# EAGLE design main (EAGLE 6.5.0)
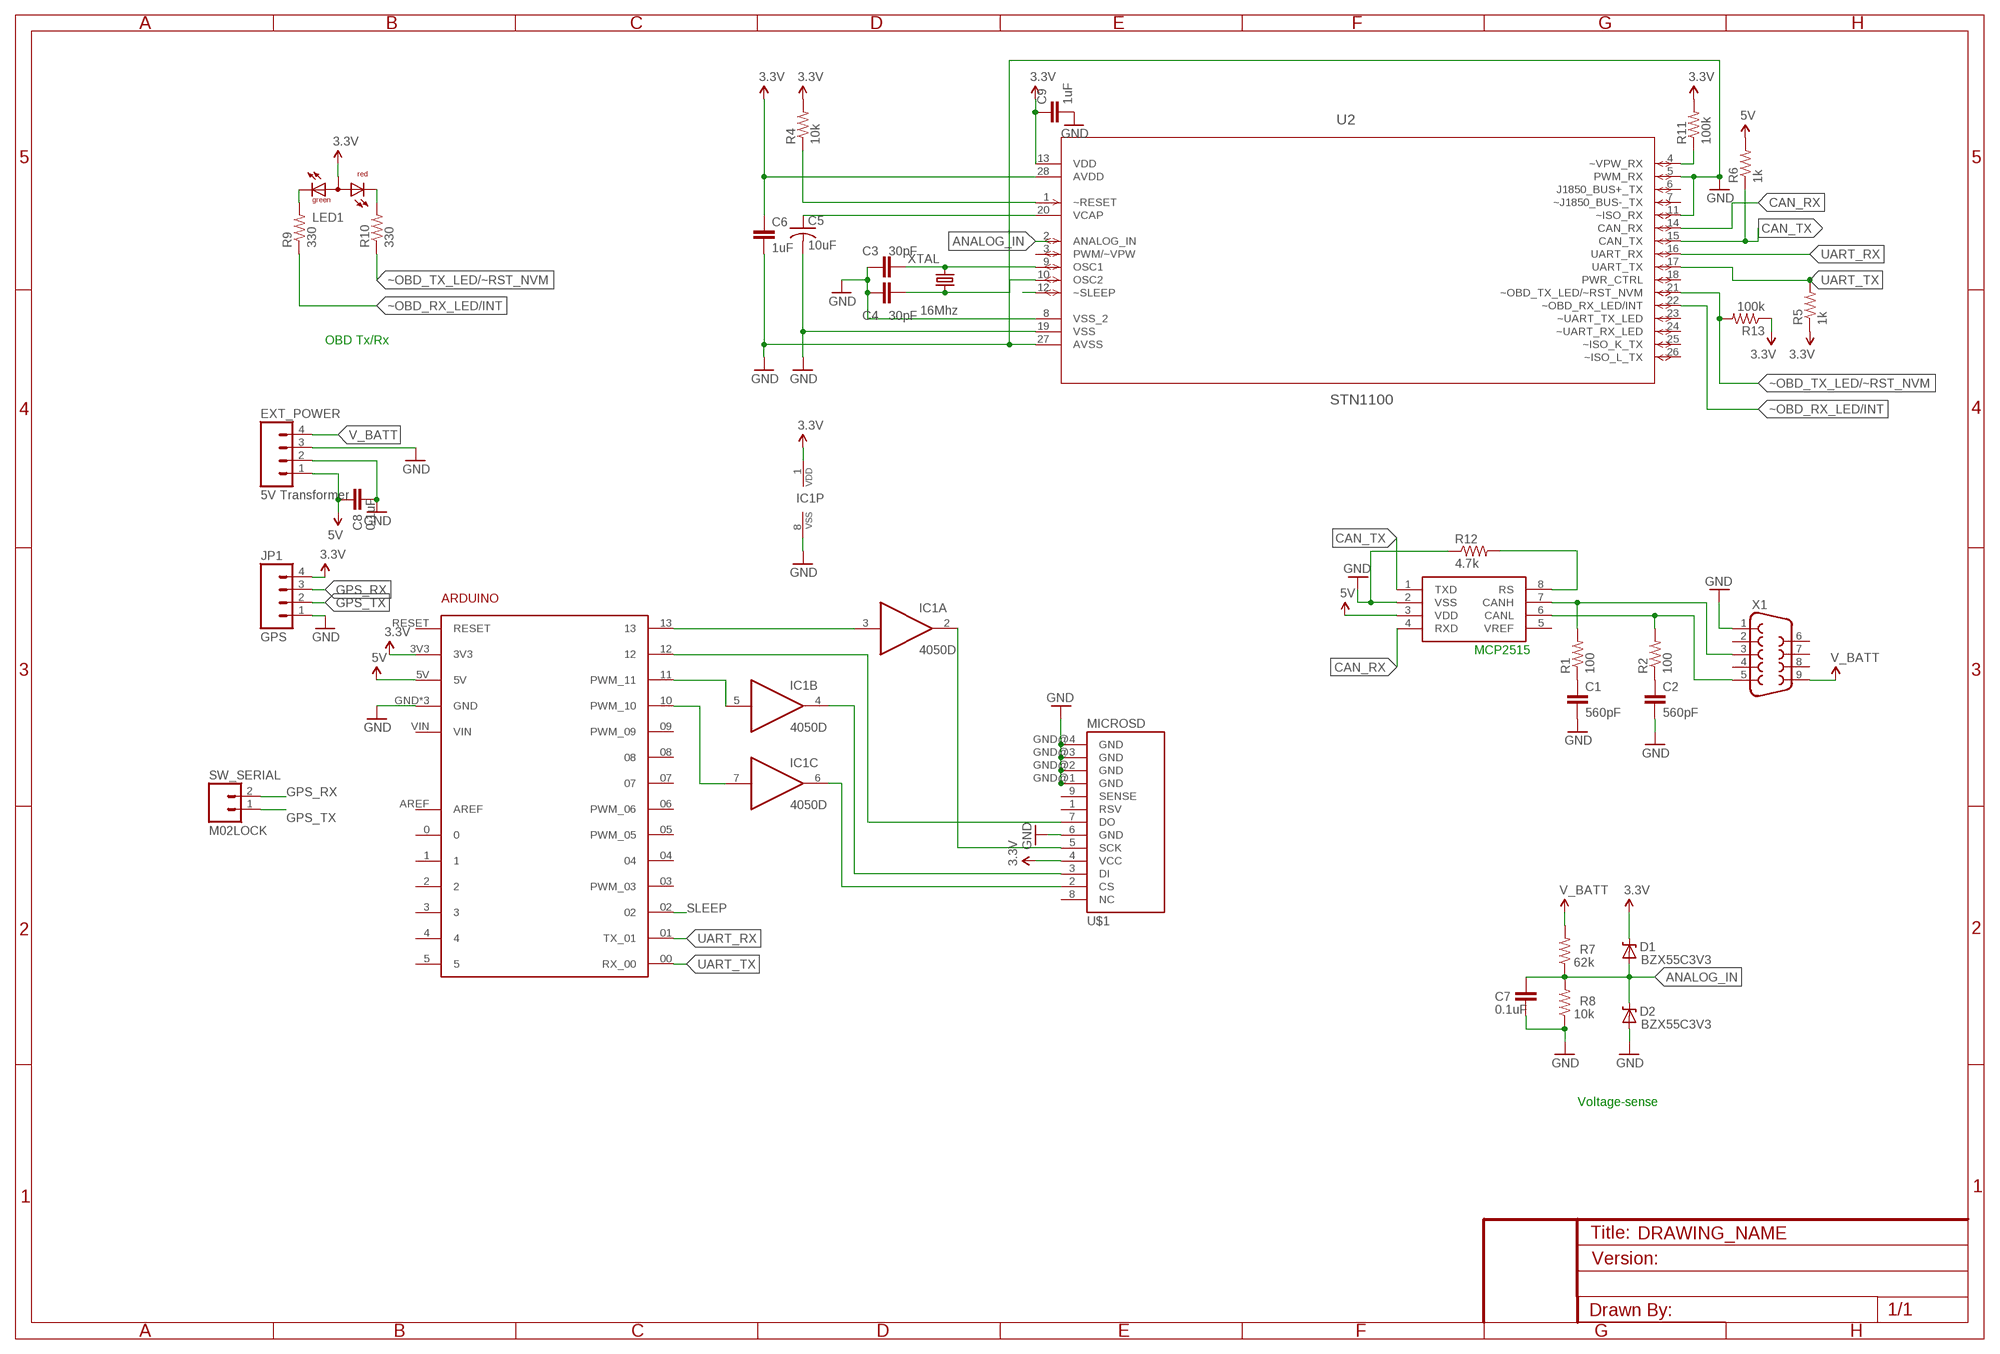
[diagram p0: schematic, sheet 1]

## Parts
ARDUINO1  ARDUINO  [ARDUINO]
C1  560pF  C-EU025-024X044  [C025-024X044]
C2  560pF  C-EU025-024X044  [C025-024X044]
C3  30pF  C2.5/2  [C2.5-2]
C4  30pF  C2.5/2  [C2.5-2]
C5  10uF  C-US025-024X044  [C025-024X044]
C6  1uF  C2.5/2  [C2.5-2]
C7  0.1uF  C2.5/2  [C2.5-2]
C8  0.1uF  C2.5/2  [C2.5-2]
C9  1uF  C2.5/2  [C2.5-2]
D1  BZX55C3V3  DIODE-ZENERPTH  [DIODE-ZENER]
D2  BZX55C3V3  DIODE-ZENERPTH  [DIODE-ZENER]
EXT_POWER  5V Transformer  M04LOCK  [1X04_LOCK]
IC1  4050D  [SO16]
JP1  GPS  M04LOCK  [1X04_LOCK]
LED1  OBD RX/TX  L-115WEGW-CA  [DUOLED-A-3MM]
R1  100  R-US_0204/7  [0204/7]
R2  100  R-US_0204/7  [0204/7]
R4  10k  R-US_0204/7  [0204/7]
R5  1k  R-US_0204/7  [0204/7]
R6  1k  R-US_0204/7  [0204/7]
R7  62k  R-US_0204/7  [0204/7]
R8  10k  R-US_0204/7  [0204/7]
R9  330  R-US_0204/7  [0204/7]
R10  330  R-US_0204/7  [0204/7]
R11  100k  R-US_0204/7  [0204/7]
R12  4.7k  R-US_0204/7  [0204/7]
R13  100k  R-US_0204/7  [0204/7]
SW_SERIAL  M02LOCK  [1X02_LOCK]
U1  MCP2551  MCP2551P-SOCKET  [SOCKET-08]
U2  STN1100  STN1110SOCKET-28  [SOCKET-28-3]
U$1  MICROSD  MICROSD_PP  [MICROSD_PP]
X1  DB9MALE  [DB9_MALE]
XTAL  16Mhz  CRYSTALHC49UV  [HC49U-V]

## Nets
3.3V: ARDUINO1.3V3 C9.1 D1.P$1(C) IC1.1(P:VDD) JP1.4 LED1.2(A) R4.2 R5.1 R11.2 R13.1 U2.13(VDD) U$1.4(VCC)
5V: ARDUINO1.5V C8.1 EXT_POWER.1 R6.2 U1.3(VDD)
ANALOG_IN: C7.1 D1.P$2(A) D2.P$1(C) R7.1 R8.2 U2.2(ANALOG_IN)
CAN_RX: U1.4(RXD) U2.14(CAN_RX)
CAN_TX: R6.1 U1.1(TXD) U2.15(CAN_TX)
GND: ARDUINO1.GND ARDUINO1.GND2(GND) ARDUINO1.GND3(GND) C1.2 C2.2 C3.1 C4.1 C5.2 C6.2 C7.2 C8.2 C9.2 D2.P$2(A) EXT_POWER.2 EXT_POWER.3 IC1.8(P:VSS) JP1.1 R8.1 R12.1 U1.2(VSS) U2.5(PWM_RX) U2.8(VSS_2) U2.11(~ISO_RX) U2.19(VSS) U2.27(AVSS) U$1.6(GND) U$1.GND@1(GND) U$1.GND@2(GND) U$1.GND@3(GND) U$1.GND@4(GND) X1.1
GPS_RX: JP1.3 SW_SERIAL.2
GPS_TX: JP1.2 SW_SERIAL.1
N$1: R1.2 U1.7(CANH) X1.3
N$2: R2.2 U1.6(CANL) X1.5
N$3: C1.1 R1.1
N$4: C2.1 R2.1
N$5: C3.2 U2.9(OSC1) XTAL.2
N$6: C4.2 U2.10(OSC2) XTAL.1
N$7: C5.1 U2.20(VCAP)
N$8: R4.1 U2.1(~RESET)
N$9: C6.1 U2.28(AVDD)
N$10: LED1.1(CG) R9.2
N$11: LED1.3(CR) R10.2
N$12: R11.1 U2.4(~VPW_RX)
N$13: IC1.4(B:O) U$1.3(DI)
N$14: R12.2 U1.8(RS)
N$15: IC1.6(C:O) U$1.2(CS)
N$16: ARDUINO1.13 IC1.3(A:I)
N$17: IC1.2(A:O) U$1.5(SCK)
N$18: ARDUINO1.10(PWM_10) IC1.7(C:I)
N$19: ARDUINO1.12 U$1.7(DO)
N$20: ARDUINO1.11(PWM_11) IC1.5(B:I)
SLEEP: ARDUINO1.02 U2.12(~SLEEP)
UART_RX: ARDUINO1.01(TX_01) U2.16(UART_RX)
UART_TX: ARDUINO1.00(RX_00) R5.2 U2.17(UART_TX)
V_BATT: EXT_POWER.4 R7.2 X1.9
~OBD_RX_LED/INT: R9.1 U2.22(~OBD_RX_LED/INT)
~OBD_TX_LED/~RST_NVM: R10.1 R13.2 U2.21(~OBD_TX_LED/~RST_NVM)
Unconnected: ARDUINO1.0 ARDUINO1.1 ARDUINO1.2 ARDUINO1.3 ARDUINO1.03(PWM_03) ARDUINO1.4 ARDUINO1.04 ARDUINO1.5 ARDUINO1.05(PWM_05) ARDUINO1.06(PWM_06) ARDUINO1.07 ARDUINO1.08 ARDUINO1.09(PWM_09) ARDUINO1.AREF ARDUINO1.RESET ARDUINO1.VIN IC1.9(D:I) IC1.10(D:O) IC1.11(E:I) IC1.12(E:O) IC1.14(F:I) IC1.15(F:O) U1.5(VREF) U2.3(PWM/~VPW) U2.6(J1850_BUS+_TX) U2.7(~J1850_BUS-_TX) U2.18(PWR_CTRL) U2.23(~UART_TX_LED) U2.24(~UART_RX_LED) U2.25(~ISO_K_TX) U2.26(~ISO_L_TX) U$1.1(RSV) U$1.8(NC) U$1.9(SENSE) X1.2 X1.4 X1.6 X1.7 X1.8

## Notes on the sheet
- OBD Tx/Rx
- MCP2515
- Voltage-sense

## Library data of the parts
ARDUINO1 = post7_arduino:ARDUINO: For creating Arduino shields
C1 C2 = rcl:C-EU: CAPACITOR, European symbol
C3 C4 C6-C9 = capacitor-wima:C: CAPACITOR naming: grid - package width
C5 = rcl:C-US: CAPACITOR, American symbol
D1 D2 = SparkFun-DiscreteSemi:DIODE-ZENER: Zener Diode Production Part - 8199 3.4V Zener Voltage
EXT_POWER JP1 = SparkFun-Connectors:M04: Header 4 Standard 4-pin 0.1" header. Use with straight break away headers (SKU : PRT-00116), right angle break away headers (PRT-00553), swiss pins (PRT-00743), machine pins (PRT-00117), and female headers (PRT-00115). Molex polarized connector foot print use with SKU : PRT-08231 with associated crimp pins and housings. 1MM SMD Version SKU: PRT-10208
IC1 = 40xx:4050: Hex non-inverting BUFFER
LED1 = led:L-115WEGW-CA: T-1(3mm) BI-COLOR INDICATOR LAMP Source: Kingbright .. 2_colour_led_.pdf
R1 R2 R4-R13 = resistor:R-US_: RESISTOR, American symbol
SW_SERIAL = SparkFun-Connectors:M02: Standard 2-pin 0.1" header. Use with - straight break away headers ( PRT-00116) - right angle break away headers (PRT-00553) - swiss pins (PRT-00743) - machine pins (PRT-00117) - female headers (PRT-00115) Molex polarized connector foot print use with: PRT-08233 with associated crimp pins and housings. 2.54_SCREWTERM for use with PRT-10571. 3.5mm Screw Terminal footprints for PRT-08084 5mm Screw Terminal footprints for use with PRT-08433
U1 = personal:MCP2551: CAN transceiver
U2 = personal:STN1110: 16-bit Microcontrollers
U$1 = DE1594-v2:MICROSD_PP
X1 = SparkFun-Connectors:DB9: DB9 Connector Standard DB9 (D-Sub 9) serial connector. Can be used for CAN bus as well as RS485 and RS232. Footprint production proven. Spark Fun Electronics SKU : PRT-00429
XTAL = SparkFun-FreqCtrl:CRYSTAL: Various standard crystals. Proven footprints. Spark Fun Electronics SKU : COM-00534

## Board
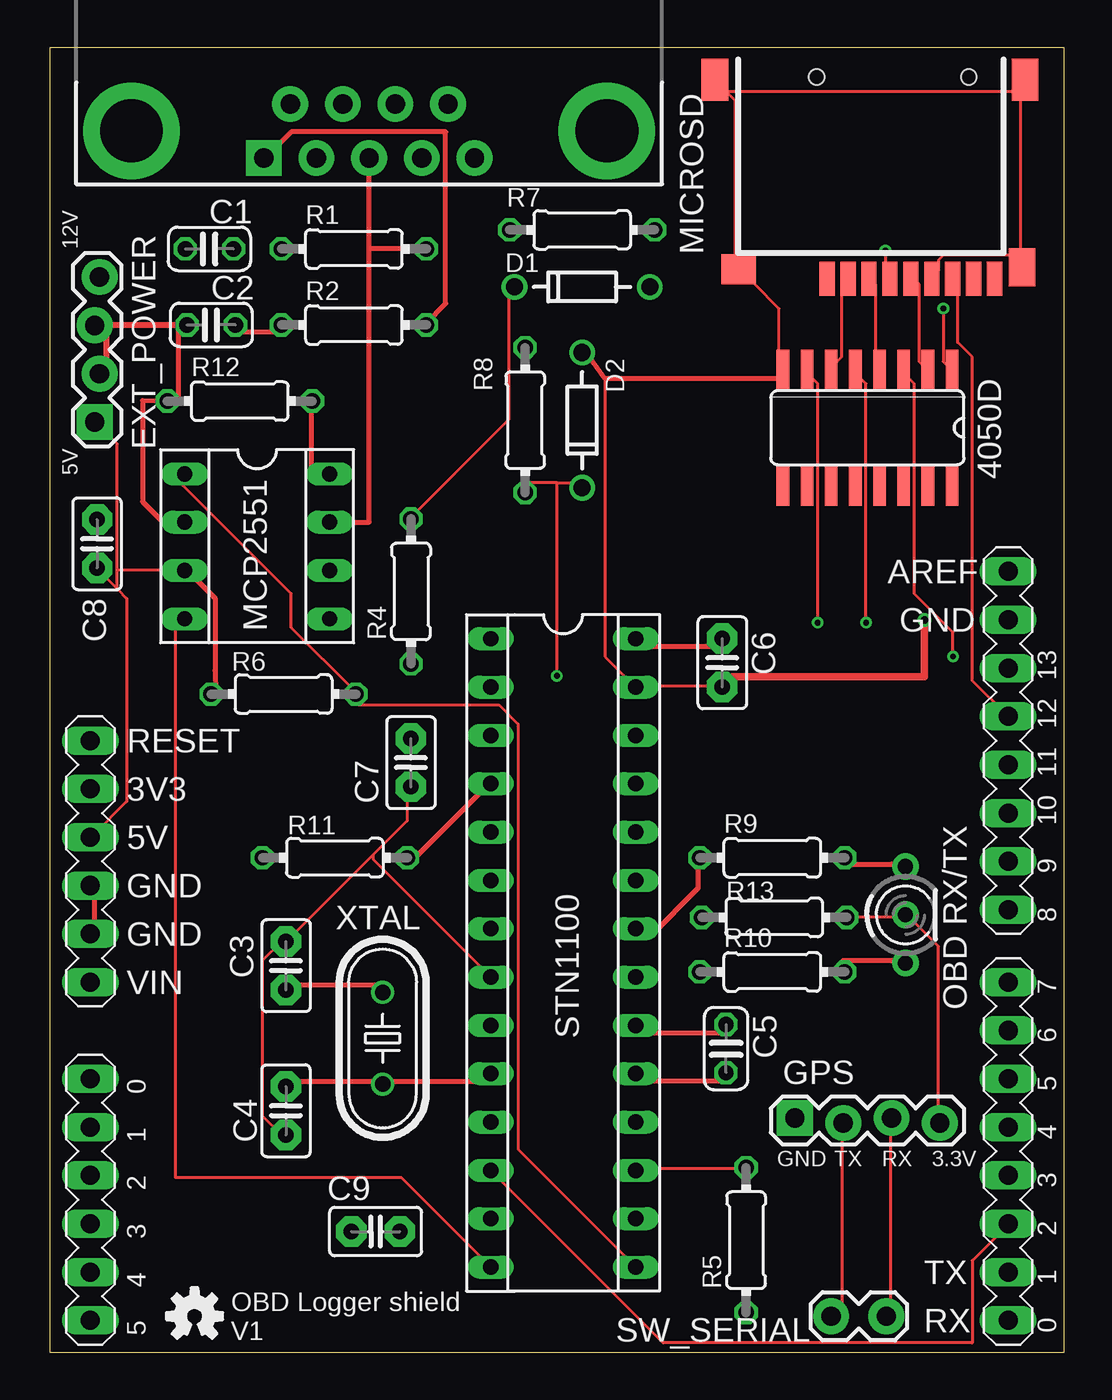
[diagram p1: board, top side]
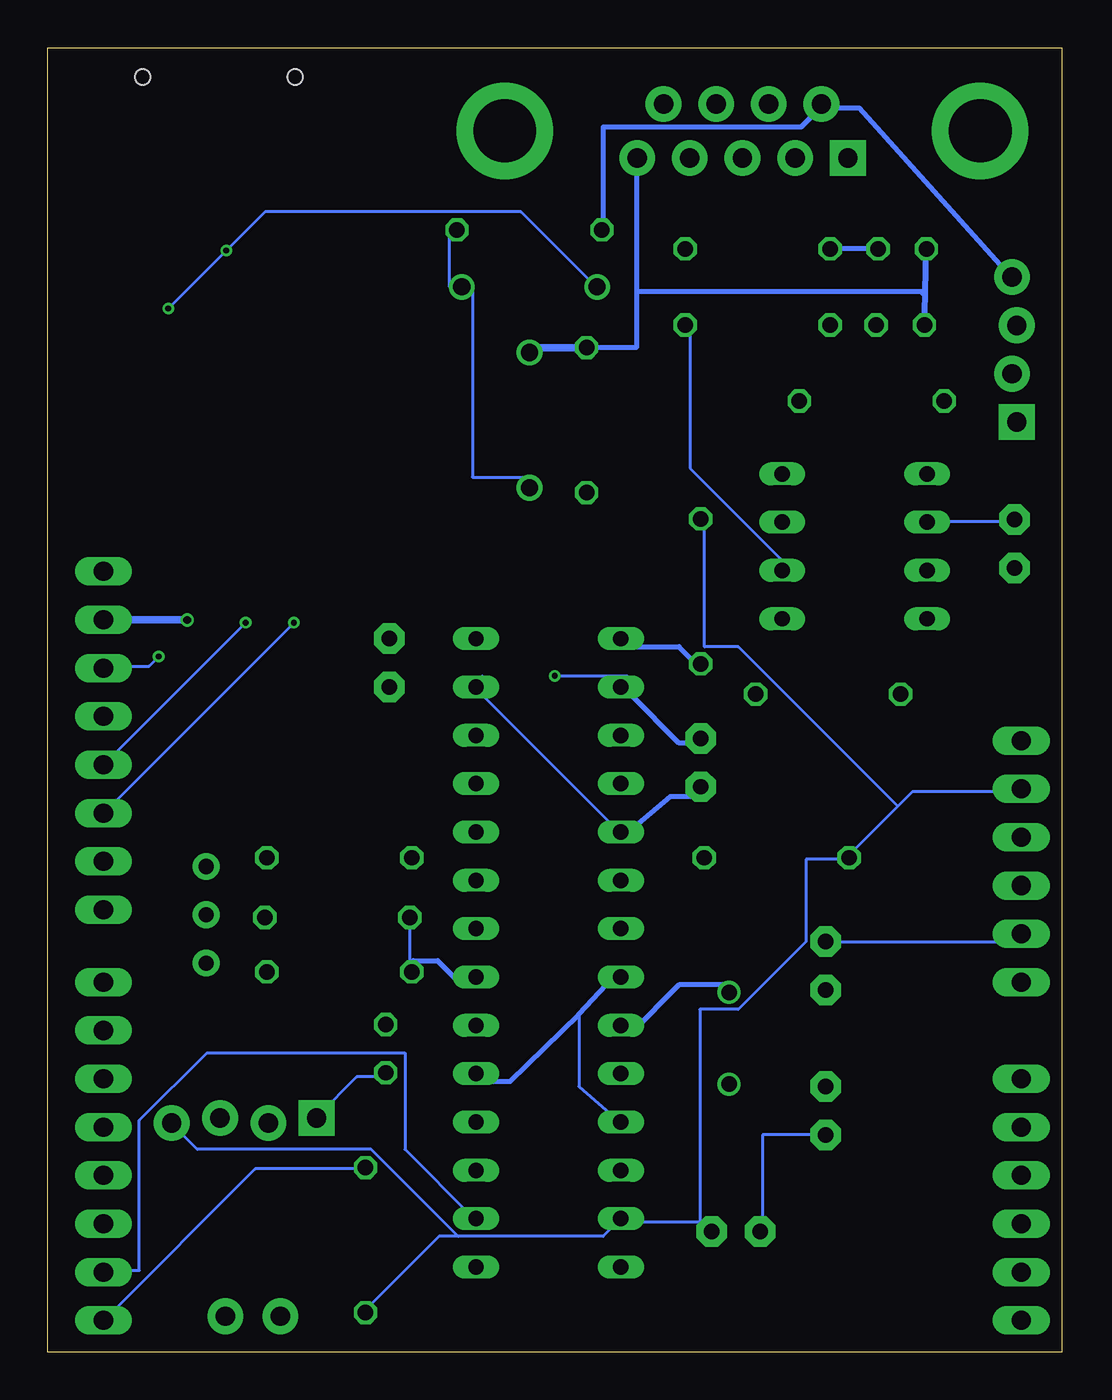
[diagram p2: board, bottom side, seen from below]

Size 53.34 x 68.58 mm. Coordinates in mm from the lower left corner, seen from the top.
Outline: 0,0 53.34,0 53.34,68.58 0,68.58 0,0
Copper layers (1*2*15*16): Top 0.035mm / dielectric 0.2mm / layer 2 0.0175mm / dielectric 1.1mm / layer 15 0.0175mm / dielectric 0.2mm / Bottom 0.035mm
Design rules "SeeedStudio_DRU_no_angle_20130527": minimum track width 6mil, minimum drill 12mil, track to track 6mil, track to pad 6mil, pad to pad 6mil, via to via 6mil, smd to smd 0mil, copper to edge 10mil, drill to drill 10mil, minimum pad ring 6mil, minimum via ring 6mil, stop-mask expansion 2mil, vias tented up to drill 25mil, thermal gap 10mil

### Footprints (pad centres in the part's own frame; a part is rotated, then mirrored left to right if it is on the bottom)
ARDUINO = drill 1 long: 00 25.4,-20.32; 0 -22.86,-7.62; 01 25.4,-17.78; 1 -22.86,-10.16; 02 25.4,-15.24; 2 -22.86,-12.7; 03 25.4,-12.7; 3 -22.86,-15.24; 3V3 -22.86,7.62; 04 25.4,-10.16; 4 -22.86,-17.78; 05 25.4,-7.62; 5 -22.86,-20.32; 5V -22.86,5.08; 06 25.4,-5.08; 07 25.4,-2.54; 08 25.4,1.27; 09 25.4,3.81; 10 25.4,6.35; 11 25.4,8.89; 12 25.4,11.43; 13 25.4,13.97; AREF 25.4,19.05; GND -22.86,0; GND2 -22.86,2.54; GND3 25.4,16.51; RESET -22.86,10.16; VIN -22.86,-2.54
C025-024X044 = drill 0.813 octagon: 1 -1.27,0; 2 1.27,0
C2.5-2 = drill 0.813 pad 1.6 octagon: 1 -1.27,0; 2 1.27,0
DIODE-ZENER = drill 0.9: P$1 -3.556,0; P$2 3.556,0
1X04_LOCK = drill 1.016 pad 1.88 square: 1 0,0.127 | drill 1.016 pad 1.88: 2 2.54,-0.127; 3 5.08,0.127; 4 7.62,-0.127
SO16 = smd 0.66 x 2.032: 1 -4.445,-3.073; 2 -3.175,-3.073; 3 -1.905,-3.073; 4 -0.635,-3.073; 5 0.635,-3.073; 6 1.905,-3.073; 7 3.175,-3.073; 8 4.445,-3.073; 9 4.445,3.073; 10 3.175,3.073; 11 1.905,3.073; 12 0.635,3.073; 13 -0.635,3.073; 14 -1.905,3.073; 15 -3.175,3.073; 16 -4.445,3.073
DUOLED-A-3MM = drill 0.8 pad 1.4: 1 -2.54,0; 2 0,0; 3 2.54,0
0204/7 = drill 0.813 octagon: 1 -3.81,0; 2 3.81,0
1X02_LOCK = drill 1.016 pad 1.88: 1 -0.178,0; 2 2.718,0
SOCKET-08 = drill 0.813 long: 1 -3.81,-3.81; 2 -1.27,-3.81; 3 1.27,-3.81; 4 3.81,-3.81; 5 3.81,3.81; 6 1.27,3.81; 7 -1.27,3.81; 8 -3.81,3.81
SOCKET-28-3 = drill 0.813 long: 1 -16.51,-3.81; 2 -13.97,-3.81; 3 -11.43,-3.81; 4 -8.89,-3.81; 5 -6.35,-3.81; 6 -3.81,-3.81; 7 -1.27,-3.81; 8 1.27,-3.81; 9 3.81,-3.81; 10 6.35,-3.81; 11 8.89,-3.81; 12 11.43,-3.81; 13 13.97,-3.81; 14 16.51,-3.81; 15 16.51,3.81; 16 13.97,3.81; 17 11.43,3.81; 18 8.89,3.81; 19 6.35,3.81; 20 3.81,3.81; 21 1.27,3.81; 22 -1.27,3.81; 23 -3.81,3.81; 24 -6.35,3.81; 25 -8.89,3.81; 26 -11.43,3.81; 27 -13.97,3.81; 28 -16.51,3.81
MICROSD_PP = smd 1.8 x 0.8: 1 0,3.85; 2 0,2.75; 3 0,1.65; 4 0,0.55; 5 0,-0.55; 6 0,-1.65; 7 0,-2.75; 8 0,-3.85; 9 0,-4.95 | smd 1.6 x 1.8: GND@1 0.5,8.5 | smd 2.2 x 1.4: GND@2 10.45,9.75; GND@4 10.45,-6.55 | smd 2 x 1.4: GND@3 0.6,-6.4 | hole 0.8: 10.6,4.4; 10.6,-3.6
DB9_MALE = drill 1.016 pad 1.88: 1 5.54,-1.42; 2 2.77,-1.42; 3 0,-1.42; 4 -2.77,-1.42; 6 4.15,1.42; 7 1.38,1.42; 8 -1.38,1.42; 9 -4.15,1.42 | drill 1.016 pad 1.88 square: 5 -5.54,-1.42 | drill 3.302 pad 5.08: G1 -12.5,0; G2 12.5,0
HC49U-V = drill 0.813: 1 -2.413,0; 2 2.413,0

### Placement (x,y rotation side)
ARDUINO1  25,22 0 top
C1  8.4,58 180 top
C2  8.5,54 180 top
C3  12.43,20.32 270 top
C4  12.43,12.7 90 top
C5  35.56,15.97 270 top
C6  35.37,36.25 270 top
C7  19,31 270 top
C8  2.5,42.5 90 top
C9  17.14,6.35 180 top
D1  28,56 0 top
D2  28,49 90 top
EXT_POWER  2.5,48.9 90 top
IC1  43,48.6 180 top
JP1  39.19,12.19 0 top
LED1  45,23 270 top
R1  16,58 0 top
R2  16,54 0 top
R4  19,40 90 top
R5  36.62,5.9 90 top
R6  12.3,34.6 180 top
R7  28,59 180 top
R8  25,49 270 top
R9  38,26 0 top
R10  38,20 0 top
R11  15,26 180 top
R12  10,50 0 top
R13  38.1,22.86 180 top
SW_SERIAL  41.27,1.91 0 top
U1  10.91,42.37 270 top
U2  27,21 270 top
U$1  44.73,56.43 90 top
U$2  [OSHW-LOGO-S]  7.62,1.91 0 top
X1  16.8,64.2 0 top
XTAL  17.51,16.51 90 top

### Tracks (layer width: path | path; a pad name or v marks a point on that pad's centre or on a via)
3.3V  (via drill 0.3)
  Top 0.152: v43.94,57.91 43.94,56.64 U$1.4 | v46.99,54.86 46.99,52.07 47.24,51.82 IC1.1 | R13.1 44.96,22.86 LED1.2 45.21,22.86 46.74,21.34 46.74,12.19 JP1.4 | R4.2 19.05,43.94 24.13,49.02 24.13,55.63 24.38,55.88 D1.P$1
  Bottom 0.152: D1.P$1 24.64,56.13 28.45,59.94 41.91,59.94 v43.94,57.91 v46.99,54.86 | 31.75,6.1 24.13,6.1 23.37,6.86 U2.13 23.11,6.86 19.05,6.86 | 31.75,6.1 32.77,6.1 36.58,2.29 R5.1 | 31.75,6.1 36.32,10.67 45.47,10.67 46.74,11.94 JP1.4 | 19.05,6.86 18.54,6.35 C9.1 | 8.64,28.7 7.87,29.46 2.29,29.46 ARDUINO1.3V3 | 8.64,28.7 11.18,26.16 R11.2 11.43,25.91 13.46,25.91 13.46,21.59 17.02,18.03 19.05,18.03 19.05,6.86 | 8.64,28.7 17.02,37.08 18.8,37.08 18.8,43.69 R4.2
5V
  Top 0.152: 3.56,40.13 2.54,41.15 C8.1 | 3.56,40.13 4.06,39.62 4.06,28.96 2.29,27.18 ARDUINO1.5V | 3.56,40.13 3.56,41.15 | 3.56,41.15 3.56,47.75 2.54,48.77 EXT_POWER.1 | 3.56,41.15 6.86,41.15 U1.3
  Top 0.254: R6.2 8.73,34.66 8.7,35.83 8.7,39.64 7.43,40.91 U1.3
ANALOG_IN  (via drill 0.3)
  Top 0.152: v26.67,35.56 26.67,45.72 | 26.67,45.72 25,45.72 | 26.67,45.72 28,45.72 D2.P$1
  Top 0.254: 25,45.72 R8.2
  Bottom 0.152: v26.67,35.56 22.86,35.56 U2.2 | 28,46 31,46 31,56 D1.P$2 32.2,56 32.2,58.61 R7.1
  Bottom 0.254: U2.2 22.67,34.56 20.13,32.02 18.86,32.02 C7.1 | 28,46 D2.P$1
CAN_RX
  Top 0.152: U2.14 23.11,4.57 18.49,9.2 6.6,9.2 6.6,38.35 U1.4
CAN_TX
  Top 0.152: U2.15 30.73,4.57 24.64,10.67 24.64,33.02 23.62,34.04 16.26,34.04 16.26,34.54 R6.1 16,34.8 12.7,38.1 12.7,39.88 6.6,45.97 U1.1
GND  (via drill 0.4)
  Top 0.152: 35.89,35.5 C6.2 35.31,35.05 30.99,35.05 U2.27 30.73,35.05 29.21,36.58 29.21,51.18 | 6.76,50 6.09,49.9 R12.1 | EXT_POWER.3 2.54,54.1 3.05,54.1 3.1,54 | 51.05,57.66 46.99,57.66 46.74,57.41 46.74,56.9 46.48,56.64 U$1.6 | 51.05,57.66 51.05,57.15 U$1.GND@3 51.05,57.66 | 51.05,57.66 51.05,66.3 | 51.05,66.3 51.05,66.8 U$1.GND@4 51.05,66.3 | 37.08,56.14 36.32,56.9 U$1.GND@1 | 38.35,51.69 IC1.8 | 35.56,66.3 36.07,65.79 36.07,57.15 U$1.GND@1 | 35.56,66.3 35.05,66.8 U$1.GND@2 35.56,66.3 | 38.35,51.18 38.35,51.43 IC1.8 | 28.19,52.58 D2.P$2 | 35.56,66.3 51.05,66.3 | 4.83,44.7 4.89,44.72 | U$1.GND@1 37.08,56.13 38.35,54.86 38.35,51.82 IC1.8 | C4.1 12.19,11.43 11.18,12.45 11.18,20.57 12.19,21.59 C3.1 12.45,21.59 17.02,26.16 | 17.02,26.16 18.8,27.94 18.8,29.72 C7.2 | 17.02,26.16 17.02,25.91 23.11,19.81 U2.8
  Top 0.254: U2.19 31.56,14.24 35.37,14.24 C5.2 | ARDUINO1.GND 2.35,21.86 2.35,24.4 ARDUINO1.GND2 | C2.2 6.76,54.01 6.76,50 4.89,50.03 4.89,44.72 6.16,43.45 U1.2 | 38.35,51.18 29.21,51.18 28.19,52.58
  Top 0.305: EXT_POWER.2 3,51.81 3,53.9 3.1,54 C2.2
  Top 0.406: 35.89,35.5 46,35.5 v46,38.5
  Bottom 0.152: 23.14,27.06 U2.5 23.37,27.43 30.73,34.8 U2.27 30.48,35.56 | 19.05,29.21 C7.2 | ARDUINO1.GND3 | 24.89,52.83 R8.1 | 7.17,55.51 7.21,54.61 | C8.2 2.54,43.69 6.86,43.69 U1.2 | C3.1 2.54,21.59 2.29,21.84 ARDUINO1.GND | 25.4,17.78 25.4,13.97 23.37,12.19 U2.11 | JP1.1 39.12,12.45 37.08,14.48 35.56,14.48 C5.2 | C4.1 15.75,11.43 15.75,6.35 C9.2
  Bottom 0.254: U2.8 23.94,19.32 25.4,17.78 29.02,14.24 30.29,14.24 U2.19 | 23.14,27.06 20.59,29.21 19.05,29.21 | 22.35,55.76 22.35,52.83 24.89,52.83 | 22.35,55.76 22.35,62.62 X1.1 | 7.17,55.51 7.42,55.76 22.35,55.76
  Bottom 0.305: C2.2 7.21,54.61 C1.2
  Bottom 0.406: R8.1 28,52.81 D2.P$2 | v46,38.5 ARDUINO1.GND3
GPS_RX
  Top 0.152: SW_SERIAL.2 44.2,2.03 44.2,12.19 JP1.3
GPS_TX
  Top 0.152: SW_SERIAL.1 41.15,2.03 41.66,2.54 41.66,11.94 JP1.2
N$1
  Top 0.254: U1.7 16.8,43.64 16.8,58 | 16.8,58 X1.3 | R1.2 16.8,58
N$2
  Top 0.152: 19.81,54.1 R2.2
  Top 0.254: 19.81,54.1 20.83,55.12 20.83,64.15 12.7,64.15 11.43,62.88 X1.5
  Bottom 0.152: U1.6 14.22,41.15 19.56,46.48 19.56,53.85 R2.2
N$3
  Bottom 0.254: C1.1 R1.1
N$4
  Top 0.254: C2.1 10,53.61 12.51,53.61 R2.1
N$5
  Top 0.254: XTAL.2 17.59,19.32 12.51,19.32 C3.2
  Bottom 0.254: U2.9 22.67,16.78 20.13,19.32 17.59,19.32 XTAL.2
N$6
  Top 0.254: 17.59,14.24 12.51,14.24 C4.2 | 17.59,14.24 22.67,14.24 U2.10 | 17.59,14.24 XTAL.1
N$7
  Top 0.254: U2.20 31.56,16.78 35.37,16.78 C5.1
N$8
  Bottom 0.254: R4.1 18.86,35.83 20.13,37.1 22.67,37.1 U2.1
N$9
  Top 0.254: U2.28 31.56,37.1 35.37,37.1 C6.1
N$10
  Top 0.254: LED1.1 44.26,25.67 41.72,25.67 R9.2
N$11
  Top 0.254: R10.2 41.72,20.59 44.26,20.59 LED1.3
N$12
  Top 0.254: R11.1 18.86,25.67 22.67,29.48 U2.4
N$13
  Top 0.152: U$1.3 43.18,56.39 43.43,56.13 43.43,51.82 IC1.4
N$14
  Top 0.254: R12.2 13.78,49.8 13.78,45.99 U1.8
N$15
  Top 0.152: U$1.2 41.91,56.39 41.66,56.13 41.66,52.32 41.15,51.82 IC1.6
N$16  (via drill 0.3)
  Top 0.152: v47.5,36.58 47.5,37.85 45.47,39.88 45.47,50.92 44.96,51.43 IC1.3
  Bottom 0.152: v47.5,36.58 48.01,36.07 50.29,36.07 ARDUINO1.13
N$17
  Top 0.152: U$1.5 45.47,56.39 45.72,56.13 45.72,52.07 45.97,51.82 IC1.2
N$18  (via drill 0.3)
  Top 0.152: v40.39,38.35 40.39,50.92 39.88,51.43 IC1.7
  Bottom 0.152: v40.39,38.35 50.29,28.45 ARDUINO1.10
N$19
  Top 0.152: U$1.7 47.5,56.39 47.75,56.13 47.75,53.09 48.51,52.32 48.51,35.31 50.29,33.53 ARDUINO1.12
N$20  (via drill 0.3)
  Top 0.152: v42.93,38.35 42.93,50.92 42.42,51.43 IC1.5
  Bottom 0.152: v42.93,38.35 50.29,30.99 ARDUINO1.11
SLEEP
  Top 0.152: U2.12 23.37,9.4 32.26,0.51 48.51,0.51 48.51,4.83 50.29,6.6 ARDUINO1.02
UART_RX
  Bottom 0.152: U2.16 30.99,7.11 34.54,10.67 34.54,15.75 44.96,15.75 48.51,12.19 48.51,4.32 50.29,4.32 ARDUINO1.01
UART_TX
  Top 0.152: U2.17 30.99,9.65 36.58,9.65 R5.2
  Bottom 0.152: ARDUINO1.00 50.29,1.78 42.42,9.65 36.83,9.65 R5.2
V_BATT
  Bottom 0.152: 24.13,59.18 R7.2 | 12.7,65.42 X1.9 12.45,65.42 | 2.79,56.64 EXT_POWER.4
  Bottom 0.254: 24.13,59.18 24.13,64.4 13.72,64.4 12.7,65.42 | 2.79,56.64 10.67,65.42 12.45,65.42
~OBD_RX_LED/INT
  Top 0.254: U2.22 31.56,21.86 34.1,24.4 34.1,25.67 R9.1
~OBD_TX_LED/~RST_NVM
  Bottom 0.152: R13.2 34.29,20.57 34.04,20.57 R10.1
  Bottom 0.254: U2.21 31.56,19.32 32.83,20.59 34.1,20.59 R10.1

### Text on the board
tPlace: OBD Logger shield / V1
tNames: 12V | 5V | GND | TX | RX | 3.3V